# Altium project LED Cotrol Board.PrjPcb
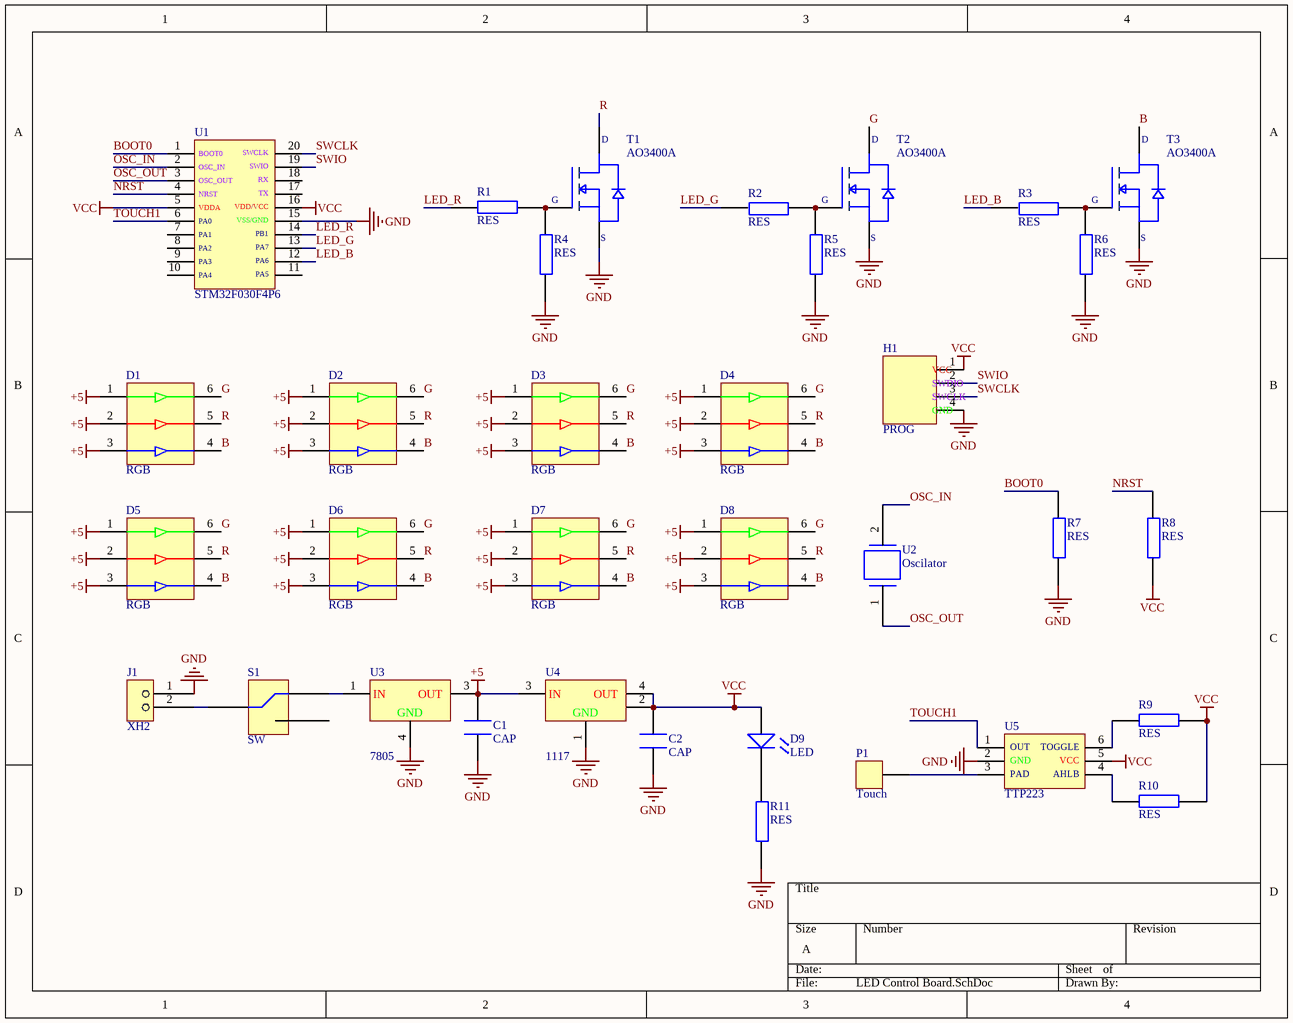
[diagram p0: LED Control Board.SchDoc]
1 sheet, 34 parts. Net scope: global (net labels, ports and power ports of the same name join across sheets).
Board file: LED CTRL BOARD.PcbDoc

## Sheet LED Control Board.SchDoc
size A; SheetNumber: 1; SheetTotal: 1

### Parts
C1  CAP  [CAP1206]
C2  CAP  [CAP1206]
D1  RGB  [RGB LED SMD]
D2  RGB  [RGB LED SMD]
D3  RGB  [RGB LED SMD]
D4  RGB  [RGB LED SMD]
D5  RGB  [RGB LED SMD]
D6  RGB  [RGB LED SMD]
D7  RGB  [RGB LED SMD]
D8  RGB  [RGB LED SMD]
D9  LED  [LED RED 1206]
H1  PROG  [PROGRAMER]
J1  XH2  [XH 2pin]
P1  Touch  [Touch]
R1  RES  [RES1206]
R2  RES  [RES1206]
R3  RES  [RES1206]
R4  RES  [RES1206]
R5  RES  [RES1206]
R6  RES  [RES1206]
R7  RES  [RES1206]
R8  RES  [RES1206]
R9  RES  [RES805]
R10  RES  [RES805]
R11  RES  [RES1206]
S1  SW  [SS-12D00G3]
T1  AO3400A  [AO3400A]
T2  AO3400A  [AO3400A]
T3  AO3400A  [AO3400A]
U1  STM32F030F4P6  [STM32F030F4P6]
U2  Oscilator  [Crystal Oscilator]
U3  7805  [7805 (SOT-252)]
U4  1117  [AMS1117]
U5  TTP223  [TTP223]

### Nets
+5: C1.2 D1.1 D1.2 D1.3 D2.1 D2.2 D2.3 D3.1 D3.2 D3.3 D4.1 D4.2 D4.3 D5.1 D5.2 D5.3 D6.1 D6.2 D6.3 D7.1 D7.2 D7.3 D8.1 D8.2 D8.3 U3.3 U4.3
GND: C1.1 C2.1 H1.4 J1.1 R4.2 R5.2 R6.2 R7.2 R11.2 T1.2 T2.2 T3.2 U1.15 U3.4 U4.1 U5.2
VCC: C2.2 D9.1 H1.1 R8.2 R9.2 R10.2 U1.5 U1.16 U4.2 U4.4 U5.5
B: D1.4 D2.4 D3.4 D4.4 D5.4 D6.4 D7.4 D8.4 T3.3
BOOT0: R7.1 U1.1
G: D1.6 D2.6 D3.6 D4.6 D5.6 D6.6 D7.6 D8.6 T2.3
LED_B: R3.2 U1.12
LED_G: R2.2 U1.13
LED_R: R1.1 U1.14
NRST: R8.1 U1.4
OSC_IN: U1.2 U2.2
OSC_OUT: U1.3 U2.1
R: D1.5 D2.5 D3.5 D4.5 D5.5 D6.5 D7.5 D8.5 T1.3
SWCLK: H1.3 U1.20
SWIO: H1.2 U1.19
TOUCH1: U1.6 U5.1
NetD9_2: D9.2 R11.1
NetJ1_2: J1.2 S1.2
NetP1_1: P1.1 U5.3
NetR1_2: R1.2 R4.1 T1.1
NetR2_1: R2.1 R5.1 T2.1
NetR3_1: R3.1 R6.1 T3.1
NetR9_1: R9.1 U5.6
NetR10_1: R10.1 U5.4
NetS1_1: S1.1 U3.1

Not connected (* = marked no-connect by the designer): S1 3; U1 7 8 9 10 11 17 18

### Notes on the sheet
- (in symbol 7805 (SOT-252)) IN; OUT; GND
- (in symbol AMS1117) IN; OUT; GND
- (in symbol AO3400A) D; G; S
- (in symbol Programmer) VCC; SWDIO; SWCLK; GND
- (in symbol STM32F030F4P6) BOOT0; SWCLK; OSC_IN; SWIO; OSC_OUT; RX; NRST; TX; VDDA; VDD/VCC; PA0; VSS/GND; PA1; PB1; PA2; PA7; PA3; PA6; PA4; PA5
- (in symbol TTP223) OUT; TOGGLE; GND; VCC; PAD; AHLB

### Library data of the parts
C1 C2 = CAP1206: Capacitor SMD 1206
D1-D8 = RGB LED SMD
D9 = LED SMD 1206
H1 = Programmer
J1 = XH 2PIN: XH Connector 2pins
P1 = Touch: Touch Pad
R1-R8 R11 = RES1206: RESISTOR SMD
R9 R10 = RES805: RESISTOR SMD
S1 = SS-12D00G3: SWITCH SPDT
U2 = Crystal: Crystal Oscilator 8MHz
U3 = 7805 (SOT-252): 5v Regulator
U4 = AMS1117: 3.3v Regulator
U5 = TTP223: Touch Drive IC